# EAGLE design Printplaat version 1 with 4-20mA problems (EAGLE 9.7.0)
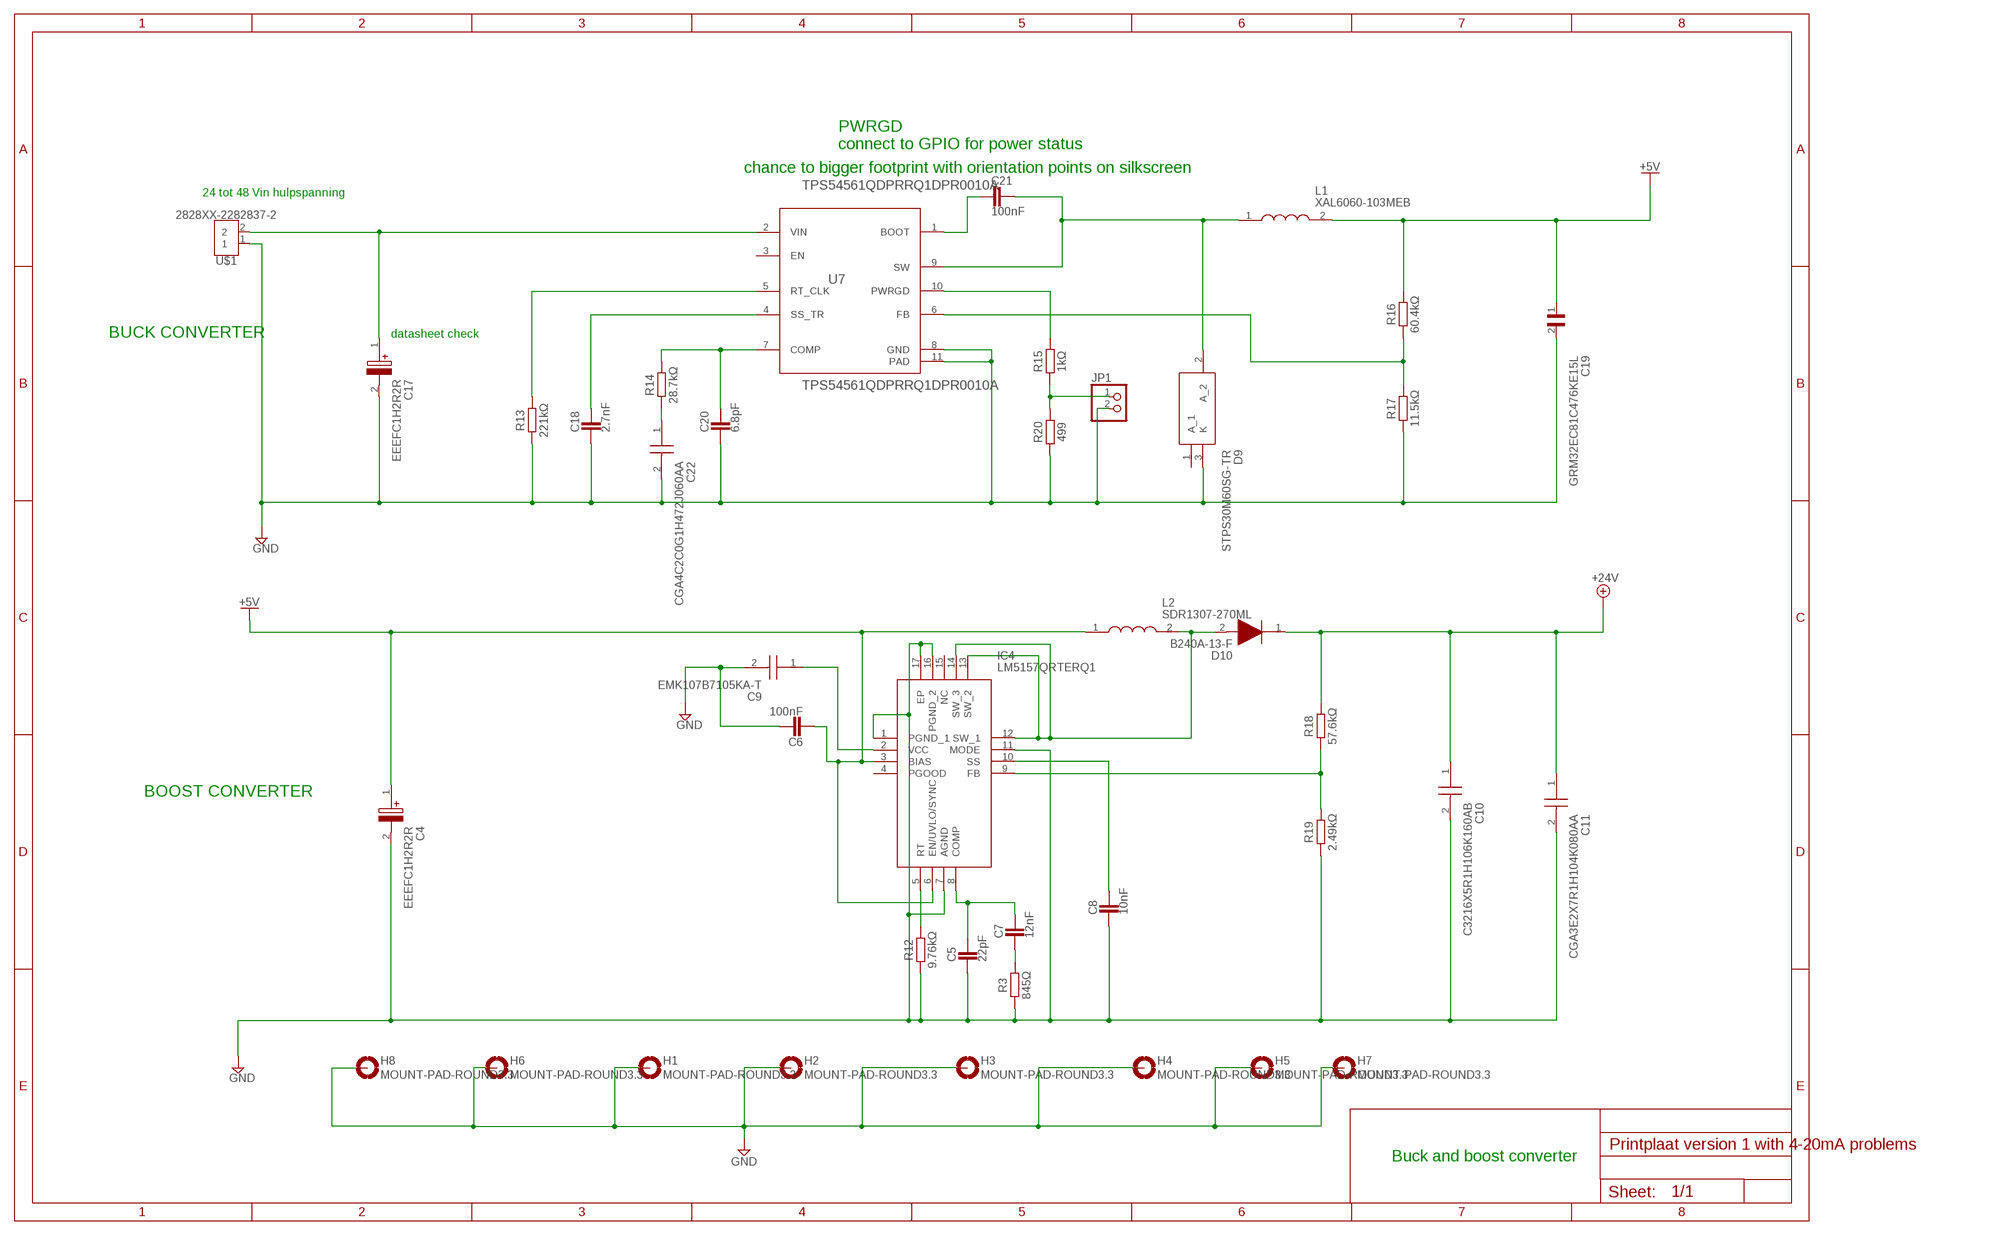
[diagram p0: schematic, sheet 1, part 1 of 3]
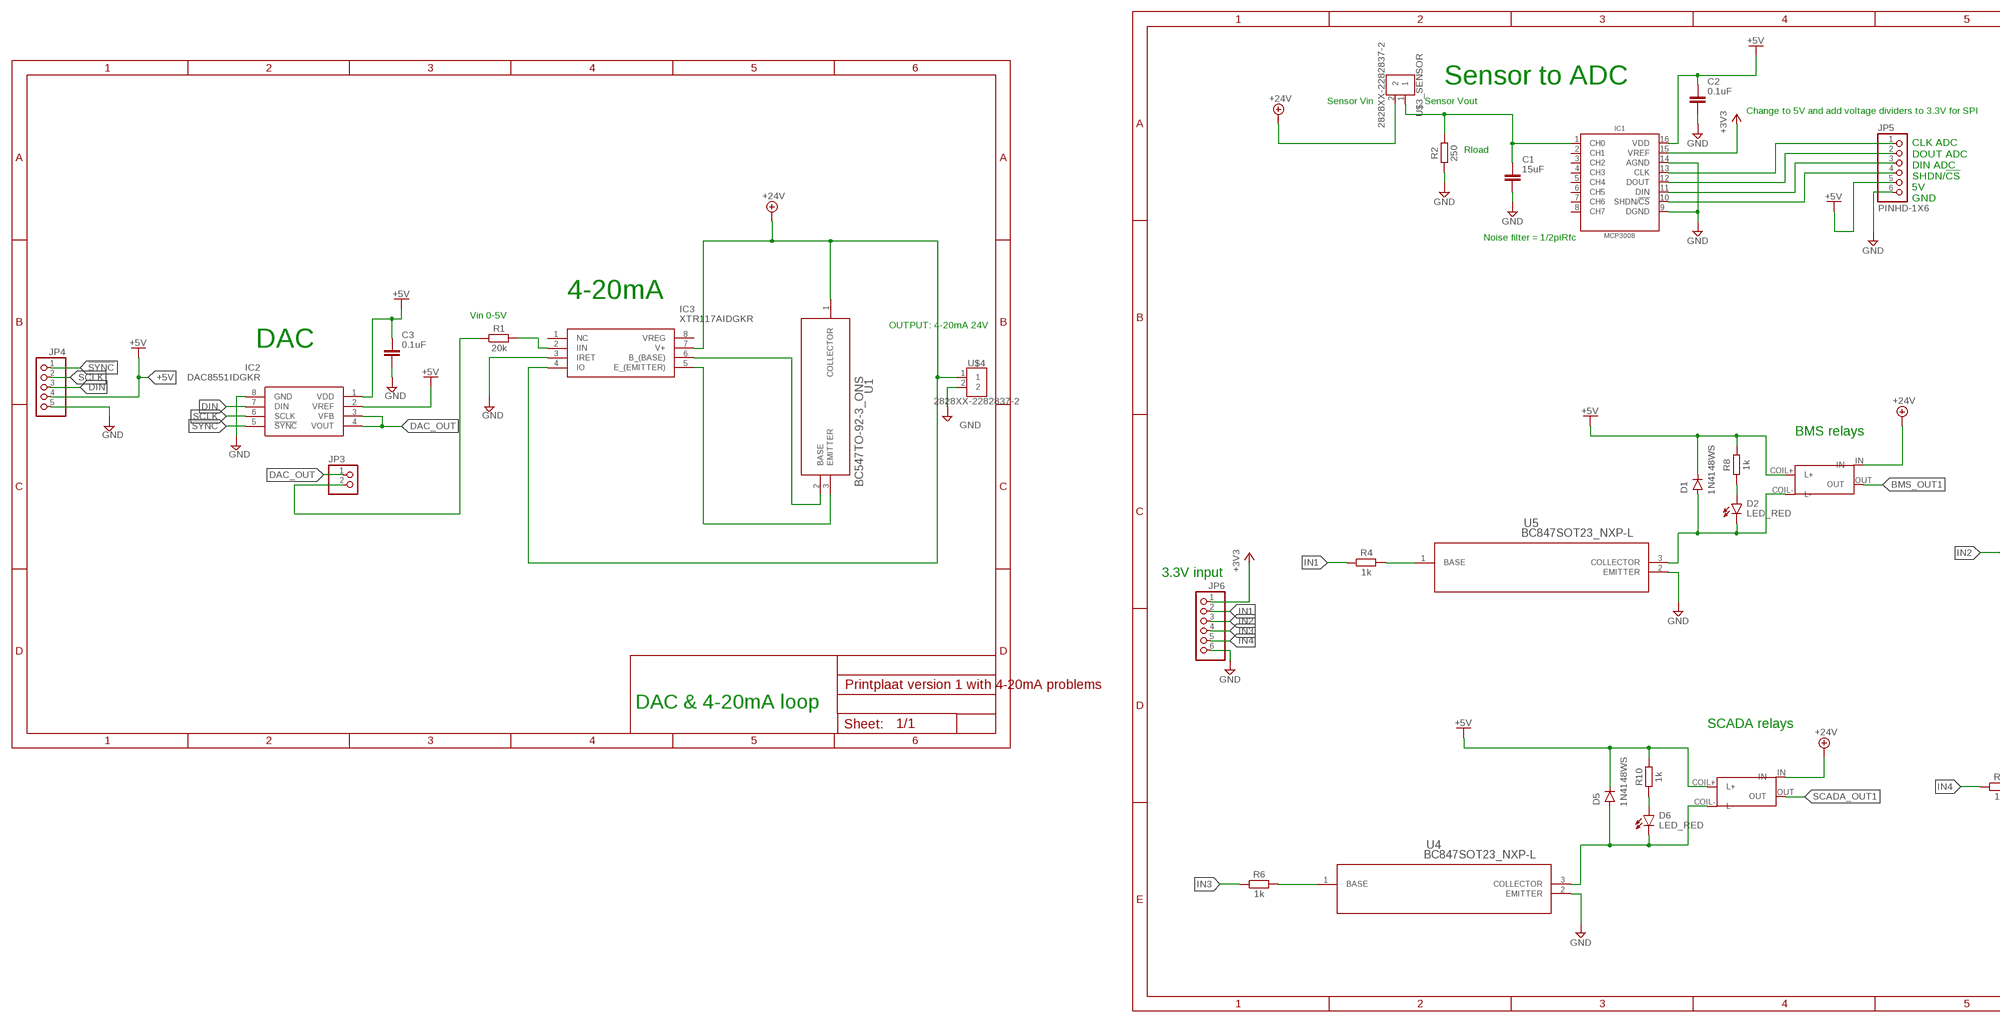
[diagram p1: schematic, sheet 1, part 2 of 3]
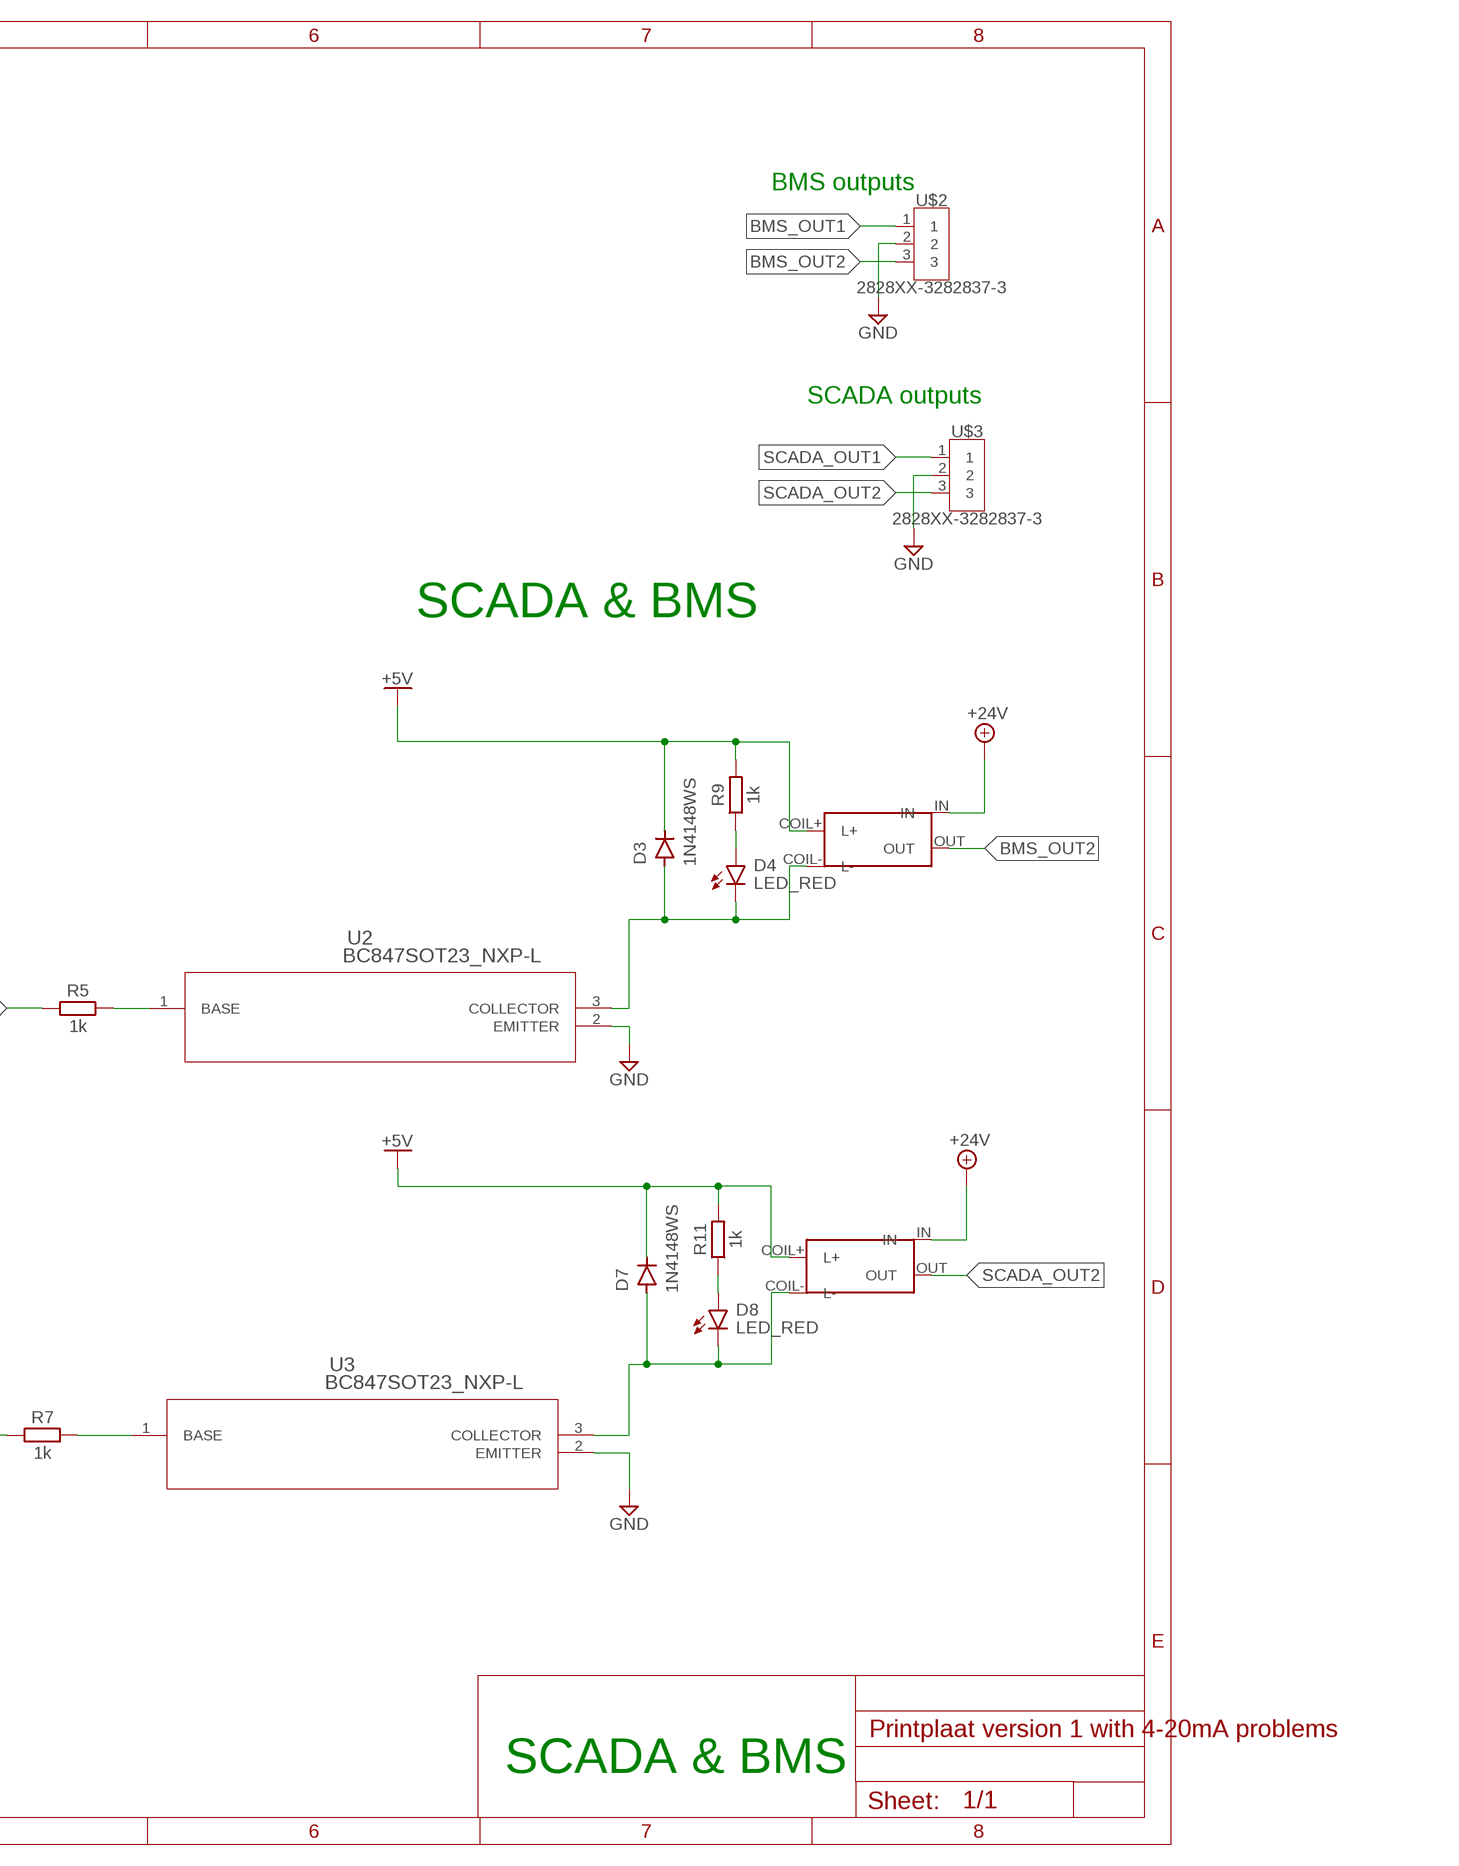
[diagram p2: schematic, sheet 1, part 3 of 3]

## Parts
C1  15uF  C_CHIP-1206(3216-METRIC)  [CAPC3216X135]
C2  0.1uF  C_CHIP-1206(3216-METRIC)  [CAPC3216X135]
C3  0.1uF  C_CHIP-1206(3216-METRIC)  [CAPC3216X135]
C4  EEEFC1H2R2R  [EEE1AA220WR]
C5  22pF  CAPACITOR_CHIP-1206(3216-METRIC)  [CAPC3216X135]
C6  100nF  CAPACITOR_CHIP-1206(3216-METRIC)  [CAPC3216X135]
C7  12nF  CAPACITOR_CHIP-1206(3216-METRIC)  [CAPC3216X135]
C8  10nF  CAPACITOR_CHIP-1206(3216-METRIC)  [CAPC3216X135]
C9  EMK107B7105KA-T  [CAPC1608X90N]
C10  C3216X5R1H106K160AB  [CAPC3216X180N]
C11  CGA3E2X7R1H104K080AA  [CAPC1608X90N]
C17  EEEFC1H2R2R  [EEE1AA220WR]
C18  2.7nF  CAPACITOR_CHIP-1206(3216-METRIC)  [CAPC3216X135]
C19  GRM32EC81C476KE15L  [CAPC3225X270N]
C20  6.8pF  CAPACITOR_CHIP-1206(3216-METRIC)  [CAPC3216X135]
C21  100nF  CAPACITOR_CHIP-1206(3216-METRIC)  [CAPC3216X135]
C22  CGA4C2C0G1H472J060AA  [CAPC2012X75N]
D1  1N4148WS  [SOD-323]
D2  LED_RED  CHIP-FLAT-R_1206  [LEDC3216X75N_FLAT-R]
D3  1N4148WS  [SOD-323]
D4  LED_RED  CHIP-FLAT-R_1206  [LEDC3216X75N_FLAT-R]
D5  1N4148WS  [SOD-323]
D6  LED_RED  CHIP-FLAT-R_1206  [LEDC3216X75N_FLAT-R]
D7  1N4148WS  [SOD-323]
D8  LED_RED  CHIP-FLAT-R_1206  [LEDC3216X75N_FLAT-R]
D9  STPS30M60SG-TR  [T1210T8G]
D10  B240A-13-F  [DIOM5226X230N]
H1  MOUNT-PAD-ROUND3.3  [3,3-PAD]
H2  MOUNT-PAD-ROUND3.3  [3,3-PAD]
H3  MOUNT-PAD-ROUND3.3  [3,3-PAD]
H4  MOUNT-PAD-ROUND3.3  [3,3-PAD]
H5  MOUNT-PAD-ROUND3.3  [3,3-PAD]
H6  MOUNT-PAD-ROUND3.3  [3,3-PAD]
H7  MOUNT-PAD-ROUND3.3  [3,3-PAD]
H8  MOUNT-PAD-ROUND3.3  [3,3-PAD]
IC1  MCP3008  MCP3008_PDIP  [DIP1092W56P254L1905H432Q16B]
IC2  DAC8551IDGKR  [SOP65P490X110-8N]
IC3  XTR117AIDGKR  [SOP65P490X110-8N]
IC4  LM5157QRTERQ1  [QFN50P300X300X80-17N]
JP1  PINHD-1X2  [1X02]
JP3  PINHD-1X2  [1X02]
JP4  PINHD-1X5  [1X05]
JP5  PINHD-1X6  [1X06]
JP6  PINHD-1X6  [1X06]
L1  XAL6060-103MEB  [XAL6060-103MEB]
L2  SDR1307-270ML  [SDR1307270ML]
R1  20k  RESISTOR__CHIP-1206(3216-METRIC)  [RESC3216X70]
R2  250  RESISTOR__CHIP-1206(3216-METRIC)  [RESC3216X70]
R3  845Ω  RESISTOR__CHIP-1206(3216-METRIC)  [RESC3216X70]
R4  1k  RESISTOR__CHIP-1206(3216-METRIC)  [RESC3216X70]
R5  1k  RESISTOR__CHIP-1206(3216-METRIC)  [RESC3216X70]
R6  1k  RESISTOR__CHIP-1206(3216-METRIC)  [RESC3216X70]
R7  1k  RESISTOR__CHIP-1206(3216-METRIC)  [RESC3216X70]
R8  1k  RESISTOR__CHIP-1206(3216-METRIC)  [RESC3216X70]
R9  1k  RESISTOR__CHIP-1206(3216-METRIC)  [RESC3216X70]
R10  1k  RESISTOR__CHIP-1206(3216-METRIC)  [RESC3216X70]
R11  1k  RESISTOR__CHIP-1206(3216-METRIC)  [RESC3216X70]
R12  9.76kΩ  RESISTOR__CHIP-1206(3216-METRIC)  [RESC3216X70]
R13  221kΩ  RESISTOR__CHIP-1206(3216-METRIC)  [RESC3216X70]
R14  28.7kΩ  RESISTOR__CHIP-1206(3216-METRIC)  [RESC3216X70]
R15  1kΩ  RESISTOR__CHIP-1206(3216-METRIC)  [RESC3216X70]
R16  60.4kΩ  RESISTOR__CHIP-1206(3216-METRIC)  [RESC3216X70]
R17  11.5kΩ  RESISTOR__CHIP-1206(3216-METRIC)  [RESC3216X70]
R18  57.6kΩ  RESISTOR__CHIP-1206(3216-METRIC)  [RESC3216X70]
R19  2.49kΩ  RESISTOR__CHIP-1206(3216-METRIC)  [RESC3216X70]
R20  499  RESISTOR__CHIP-1206(3216-METRIC)  [RESC3216X70]
RELAY1  ZETTLER_5V_RELAY  [ZETTLER_5V_RELAY]
RELAY2  ZETTLER_5V_RELAY  [ZETTLER_5V_RELAY]
RELAY3  ZETTLER_5V_RELAY  [ZETTLER_5V_RELAY]
RELAY4  ZETTLER_5V_RELAY  [ZETTLER_5V_RELAY]
U1  BC547TO-92-3_ONS  [TO-92-3_ONS]
U2  BC847SOT23_NXP-L  [SOT23_NXP-L]
U3  BC847SOT23_NXP-L  [SOT23_NXP-L]
U4  BC847SOT23_NXP-L  [SOT23_NXP-L]
U5  BC847SOT23_NXP-L  [SOT23_NXP-L]
U7  TPS54561QDPRRQ1DPR0010A  [DPR0010A]
U$1  2828XX-2282837-2  [TERMBLK_508-2N]
U$2  2828XX-3282837-3  [TERMBLK_508-3N]
U$3  2828XX-3282837-3  [TERMBLK_508-3N]
U$3_SENSOR  2828XX-2282837-2  [TERMBLK_508-2N]
U$4  2828XX-2282837-2  [TERMBLK_508-2N]

## Nets
!SYNC: IC2.5(!SYNC) JP4.1
+3V3: IC1.15(VREF) JP6.1
+5V: C2.1 C3.1 C4.1(+) C6.2 C19.1 D1.C D3.C D5.C D7.C IC1.16(VDD) IC2.1(VDD) IC2.2(VREF) IC4.3(BIAS) IC4.6(EN/UVLO/SYNC) JP4.4 JP5.5 L1.2 L2.1 R8.2 R9.2 R10.2 R11.2 R16.2 RELAY1.COIL+(L+) RELAY2.COIL+(L+) RELAY3.COIL+(L+) RELAY4.COIL+(L+)
+24V: C10.1 C11.1 D10.1(K) IC3.4(IO) IC3.7(V+) R18.2 RELAY1.IN RELAY2.IN RELAY3.IN RELAY4.IN U1.1(COLLECTOR) U$3_SENSOR.2 U$4.1
BMS_OUT1: RELAY1.OUT U$2.1
BMS_OUT2: RELAY2.OUT U$2.3
DAC_OUT: IC2.3(VFB) IC2.4(VOUT) JP3.1
DIN: IC2.7(DIN) JP4.3
GND: C1.2 C2.2 C3.2 C4.2(-) C5.2 C6.1 C8.2 C9.2 C10.2 C11.2 C17.2(-) C18.2 C19.2 C20.2 C22.2 D9.3(K) H1.B3,3(MOUNT) H2.B3,3(MOUNT) H3.B3,3(MOUNT) H4.B3,3(MOUNT) H5.B3,3(MOUNT) H6.B3,3(MOUNT) H7.B3,3(MOUNT) H8.B3,3(MOUNT) IC1.9(DGND) IC1.14(AGND) IC2.8(GND) IC3.3(IRET) IC4.1(PGND_1) IC4.7(AGND) IC4.11(MODE) IC4.16(PGND_2) IC4.17(EP) JP1.2 JP4.5 JP5.6 JP6.6 R2.1 R3.1 R12.1 R13.1 R17.1 R19.1 R20.1 U2.2(EMITTER) U3.2(EMITTER) U4.2(EMITTER) U5.2(EMITTER) U7.8(GND) U7.11(PAD) U$1.1 U$2.2 U$3.2 U$4.2
IN1: JP6.2 R4.1
IN2: JP6.3 R5.1
IN3: JP6.4 R6.1
IN4: JP6.5 R7.1
N$1: IC3.6(B_(BASE)) U1.2(BASE)
N$2: JP3.2 R1.1
N$3: IC3.5(E_(EMITTER)) U1.3(EMITTER)
N$4: IC3.2(IIN) R1.2
N$5: R5.2 U2.1(BASE)
N$6: C1.1 IC1.1(CH0) R2.2 U$3_SENSOR.1
N$7: IC1.10(SHDN/!CS) JP5.4
N$8: IC1.11(DIN) JP5.3
N$9: IC1.12(DOUT) JP5.2
N$10: IC1.13(CLK) JP5.1
N$11: D3.A D4.C RELAY2.COIL-(L-) U2.3(COLLECTOR)
N$12: D4.A R9.1
N$13: R6.2 U4.1(BASE)
N$14: R4.2 U5.1(BASE)
N$15: D2.A R8.1
N$16: D1.A D2.C RELAY1.COIL-(L-) U5.3(COLLECTOR)
N$17: D5.A D6.C RELAY3.COIL-(L-) U4.3(COLLECTOR)
N$18: D6.A R10.1
N$19: D7.A D8.C RELAY4.COIL-(L-) U3.3(COLLECTOR)
N$20: D8.A R11.1
N$21: R7.2 U3.1(BASE)
N$22: C17.1(+) U7.2(VIN) U$1.2
N$23: R13.2 U7.5(RT_CLK)
N$24: C18.1 U7.4(SS_TR)
N$25: C22.1 R14.1
N$26: C20.1 R14.2 U7.7(COMP)
N$27: C21.2 U7.1(BOOT)
N$28: C21.1 D9.2(A_2) L1.1 U7.9(SW)
N$29: R15.2 U7.10(PWRGD)
N$30: R16.1 R17.2 U7.6(FB)
N$31: C9.1 IC4.2(VCC)
N$32: C5.1 C7.1 IC4.8(COMP)
N$33: C7.2 R3.2
N$34: C8.1 IC4.10(SS)
N$35: IC4.5(RT) R12.2
N$36: D10.2(A) IC4.12(SW_1) IC4.13(SW_2) IC4.14(SW_3) L2.2
N$37: IC4.9(FB) R18.1 R19.2
N$38: JP1.1 R15.1 R20.2
SCADA_OUT1: RELAY3.OUT U$3.1
SCADA_OUT2: RELAY4.OUT U$3.3
SCLK: IC2.6(SCLK) JP4.2
Unconnected: D9.1(A_1) IC1.2(CH1) IC1.3(CH2) IC1.4(CH3) IC1.5(CH4) IC1.6(CH5) IC1.7(CH6) IC1.8(CH7) IC3.1(NC) IC3.8(VREG) IC4.4(PGOOD) IC4.15(NC) U7.3(EN)

## Notes on the sheet
- PWRGD 
  connect to GPIO for power status
- chance to bigger footprint with orientation points on silkscreen
- 24 tot 48 Vin hulpspanning
- BUCK CONVERTER | datasheet check
- BOOST CONVERTER
- Buck and boost converter
- Sensor to ADC
- Sensor Vin | Sensor Vout | BMS outputs
- Change to 5V and add voltage dividers to 3.3V for SPI
- Rload
- CLK ADC
  DOUT ADC
  DIN ADC
  SHDN/!CS
  5V
  GND
- SCADA outputs
- Noise filter = 1/2piRfc
- 4-20mA
- Vin 0-5V
- OUTPUT: 4-20mA 24V
- SCADA & BMS
- DAC
- BMS relays
- 3.3V input
- DAC & 4-20mA loop
- SCADA relays
- SCADA & BMS

## Library data of the parts
C1-C3 = Capacitor:C: Capacitor - Generic; CATEGORY: Capacitor
C4 C17 = EEEFC1H2R2R:EEEFC1H2R2R: Panasonic 2.2uF 50V dc Aluminium Electrolytic Capacitor, Surface Mount 4 (Dia.) x 5.4mm +105C 4mm Source: Datasheet <http://industrial.panasonic.com/cdbs/www-data/pdf/RDE0000/ABA0000C1172.pdf>; DESCRIPTION: Panasonic 2.2uF 50V dc Aluminium Electrolytic Capacitor, Surface Mount 4 (Dia.) x 5.4mm +105C 4mm; HEIGHT: 5.5mm; MANUFACTURER_NAME: Panasonic; MANUFACTURER_PART_NUMBER: EEEFC1H2R2R
C5-C8 C18 C20 C21 = Tinkercad:CAPACITOR: Capacitor - Generic; CATEGORY: Capacitor
C9 = EMK107B7105KA-T:EMK107B7105KA-T: Ceramic Capacitor 0603 16V 1uF Source: Datasheet <https://componentsearchengine.com/Datasheets/1/EMK107B7105KA-T.pdf>; DESCRIPTION: Ceramic Capacitor 0603 16V 1uF; HEIGHT: 0.9mm; MANUFACTURER_NAME: TAIYO YUDEN; MANUFACTURER_PART_NUMBER: EMK107B7105KA-T; MOUSER_PART_NUMBER: 963-EMK107B7105KA-T; MOUSER_PRICE-STOCK: https://www.mouser.co.uk/ProductDetail/TAIYO-YUDEN/EMK107B7105KA-T?qs=I6KAKw0tg2zS1zj87Lm%2FxQ%3D%3D
C10 = C3216X5R1H106K160AB:C3216X5R1H106K160AB: 1206 X5R ceramic capacitor 10uF 50V TDK 1206 C 10F Ceramic Multilayer Capacitor, 50 V dc X5R Dielectric +/-10% SMD Source: Datasheet <https://product.tdk.com/info/en/catalog/datasheets/mlcc_commercial_midvoltage_en.pdf>; DESCRIPTION: 1206 X5R ceramic capacitor 10uF 50V TDK 1206 C 10F Ceramic Multilayer Capacitor, 50 V dc X5R Dielectric +/-10% SMD; HEIGHT: 1.8mm; MANUFACTURER_NAME: TDK; MANUFACTURER_PART_NUMBER: C3216X5R1H106K160AB; MOUSER_PART_NUMBER: 810-C3216X5R1H106K; MOUSER_PRICE-STOCK: https://www.mouser.co.uk/ProductDetail/TDK/C3216X5R1H106K160AB?qs=NRhsANhppD%252BLHMbxvQzsEQ%3D%3D
C11 = CGA3E2X7R1H104K080AA:CGA3E2X7R1H104K080AA: Multilayer Ceramic Chip Capacitors, Capacitance=0.1uF, LxWxT:1.6x0.8x0.8mm Source: Datasheet; DESCRIPTION: Multilayer Ceramic Chip Capacitors, Capacitance=0.1uF, LxWxT:1.6x0.8x0.8mm; HEIGHT: 0.9mm; MANUFACTURER_NAME: TDK; MANUFACTURER_PART_NUMBER: CGA3E2X7R1H104K080AA; MOUSER_PART_NUMBER: 810-CGA3E2X7R1H104K; MOUSER_PRICE-STOCK: https://www.mouser.co.uk/ProductDetail/TDK/CGA3E2X7R1H104K080AA?qs=NRhsANhppD%2Fge2a869G9Fg%3D%3D
C19 = GRM32EC81C476KE15L:GRM32EC81C476KE15L: SMD Capacitor X6S(EIA) with Capacitance: 47uF Tol. 10%. Rated Voltage: 16Vdc Check availability <https://pricing.snapeda.com/parts/GRM32EC81C476KE15L/Murata%20Electronics/view-part?ref=eda>; AVAILABILITY: In Stock; CHECK_PRICES: https://www.snapeda.com/parts/GRM32EC81C476KE15L/Murata/view-part/?ref=eda; DESCRIPTION: 47 µF ±10% 16V Ceramic Capacitor X6S 1210 (3225 Metric); MF: Murata Electronics; MP: GRM32EC81C476KE15L; PACKAGE: 3225 Murata; PRICE: None; SNAPEDA_LINK: https://www.snapeda.com/parts/GRM32EC81C476KE15L/Murata/view-part/?ref=snap
C22 = CGA4C2C0G1H472J060AA:CGA4C2C0G1H472J060AA: Multilayer Ceramic Chip Capacitors, Capacitance=4.7nF, LxWxT:2x1.25x0.6mm Source: Datasheet; DESCRIPTION: Multilayer Ceramic Chip Capacitors, Capacitance=4.7nF, LxWxT:2x1.25x0.6mm; HEIGHT: 0.75mm; MANUFACTURER_NAME: TDK; MANUFACTURER_PART_NUMBER: CGA4C2C0G1H472J060AA; MOUSER_PART_NUMBER: 810-CGA4C2C0G1H472J; MOUSER_PRICE-STOCK: https://www.mouser.co.uk/ProductDetail/TDK/CGA4C2C0G1H472J060AA?qs=FxQuwy19cyCgdYzJw5%252BHfA%3D%3D
D1 D3 D5 D7 = Diodes:1N4148WS: DIODE GEN PURP 75V 150MA SOD323F Manufacturer's datasheet <https://www.onsemi.com/pub/Collateral/1N914BWS-D.pdf>; CREATED_BY: PCBLayout.com; DIGIKEY_PART_NUMBER: 1N4148WSFSTR-ND; MANUFACTURER: Diodes Incorporated; MPN: 1N4148WS; PACKAGE: SOD-323
D2 D4 D6 D8 = LED:CHIP-FLAT-R; CATEGORY: LED; COLOR: RED; DESCRIPTION: CHIP LED FLAT; SUB-CATEGORY: CHIP; TYPE: FLAT_TOP
D9 = STPS30M60SG-TR:STPS30M60SG-TR: STMicroelectronics STPS30M60SG-TR, SMT Schottky Diode, 60V 30A, 3-Pin D2PAK Source: Datasheet <https://componentsearchengine.com/Datasheets/1/STPS30M60SG-TR.pdf>; DESCRIPTION: STMicroelectronics STPS30M60SG-TR, SMT Schottky Diode, 60V 30A, 3-Pin D2PAK; HEIGHT: 4mm; MANUFACTURER_NAME: STMicroelectronics; MANUFACTURER_PART_NUMBER: STPS30M60SG-TR; MOUSER_PART_NUMBER: 511-STPS30M60SG-TR; MOUSER_PRICE-STOCK: https://www.mouser.co.uk/ProductDetail/STMicroelectronics/STPS30M60SG-TR?qs=G49gCGQm93g67AcseEWC2A%3D%3D
D10 = B240A-13-F:B240A-13-F: Schottky Diode 2A 40V 0.5Vf SMA Diodes Inc B240A-13-F, SMT Schottky Diode, 40V 2A, 2-Pin DO-214AC Source: Datasheet <https://datasheet.datasheetarchive.com/originals/distributors/SFDatasheet-0/sf-0003166.pdf>; DESCRIPTION: Schottky Diode 2A 40V 0.5Vf SMA Diodes Inc B240A-13-F, SMT Schottky Diode, 40V 2A, 2-Pin DO-214AC; HEIGHT: 2.3mm; MANUFACTURER_NAME: Diodes Incorporated; MANUFACTURER_PART_NUMBER: B240A-13-F; MOUSER_PART_NUMBER: 621-B240A-F; MOUSER_PRICE-STOCK: https://www.mouser.co.uk/ProductDetail/Diodes-Incorporated/B240A-13-F?qs=idJYQZufS6jleWUCPMvVdQ%3D%3D
H1-H8 = holes:MOUNT-PAD-ROUND: MOUNTING PAD, round
IC1 = IC_Data-Conversion:MCP3008: 2.7V 4-Channel/8-Channel 10-Bit A/D Converters with SPI™ Serial Interface Datasheet <https://www.mouser.in/datasheet/2/268/21295b-72710.pdf>; CATEGORY: IC_Data-Conversion; DESCRIPTION: IC ADC 10BIT SAR 16DIP; MANUFACTURER: Microchip Technology; MPN: MCP3008-I/P; OPERATINGTEMP: -40 to +85°C; PART_STATUS: Active; ROHS_COMPLIANT: Compliant; SUB-CATEGORY: A/D Converter
IC2 = DAC8551IDGKR:DAC8551IDGKR: 16-Bit, Ultralow Glitch, Voltage Output, Digital to Analog Converter Source: Datasheet <http://www.ti.com/lit/gpn/DAC8551>; DESCRIPTION: 16-Bit, Ultralow Glitch, Voltage Output, Digital to Analog Converter; HEIGHT: 1.1mm; MANUFACTURER_NAME: Texas Instruments; MANUFACTURER_PART_NUMBER: DAC8551IDGKR; MOUSER_PART_NUMBER: 595-DAC8551IDGKR; MOUSER_PRICE-STOCK: https://www.mouser.co.uk/ProductDetail/Texas-Instruments/DAC8551IDGKR?qs=vul0MlC%2Fa1dStr8sTUNGkA%3D%3D
IC3 = XTR117AIDGKR:XTR117AIDGKR: Sensor Interface XTR117 4-20mA Crnt Loop Transmitter Source: Datasheet <http://www.ti.com/lit/ds/symlink/xtr117.pdf>; DESCRIPTION: Sensor Interface XTR117 4-20mA Crnt Loop Transmitter; HEIGHT: 1.1mm; MANUFACTURER_NAME: Texas Instruments; MANUFACTURER_PART_NUMBER: XTR117AIDGKR; MOUSER_PART_NUMBER: 595-XTR117AIDGKR; MOUSER_PRICE-STOCK: https://www.mouser.co.uk/ProductDetail/Texas-Instruments/XTR117AIDGKR?qs=zqbRmZ%252BfZD%252BYMdmF%252BmhQwg%3D%3D
IC4 = LM5157QRTERQ1:LM5157QRTERQ1: Switching Voltage Regulators 6-A, 50-V, 2.2-MHz wide VIN boost, flyback, & SEPIC converter with dual random spread spectrum Source: Datasheet <https://pdf1.alldatasheet.com/datasheet-pdf/view/1264204/TI/LM5157QRTERQ1.html>; DESCRIPTION: Switching Voltage Regulators 6-A, 50-V, 2.2-MHz wide VIN boost, flyback, & SEPIC converter with dual random spread spectrum; HEIGHT: 0.8mm; MANUFACTURER_NAME: Texas Instruments; MANUFACTURER_PART_NUMBER: LM5157QRTERQ1; MOUSER_PART_NUMBER: 595-LM5157QRTERQ1; MOUSER_PRICE-STOCK: https://www.mouser.co.uk/ProductDetail/Texas-Instruments/LM5157QRTERQ1?qs=QNEnbhJQKvb8%252BoI1%252BJEaeg%3D%3D
JP1 JP3 = pinhead:PINHD-1X2: PIN HEADER
JP4 = pinhead:PINHD-1X5: PIN HEADER
JP5 = Connector:PINHD-1X6: PIN HEADER; CATEGORY: CONNECTOR; SUB-CATEGORY: PIN-HEADER
JP6 = pinhead:PINHD-1X6: PIN HEADER
L1 = XAL6060-103MEB:XAL6060-103MEB: Fixed Inductors XAL6060 High Current 10 uH 20% 7 A Compos Source: Datasheet; DESCRIPTION: Fixed Inductors XAL6060 High Current 10 uH 20% 7 A Compos; HEIGHT: mm; MANUFACTURER_NAME: COILCRAFT; MANUFACTURER_PART_NUMBER: XAL6060-103MEB; MOUSER_PART_NUMBER: 994-XAL6060-103MEB; MOUSER_PRICE-STOCK: https://www.mouser.co.uk/ProductDetail/Coilcraft/XAL6060-103MEB?qs=VJjuEbE9QBODk8cxO8T25A%3D%3D
L2 = SDR1307-270ML:SDR1307-270ML: Fixed Inductors 27uH 20% SMD 1307 Source: Datasheet <https://www.bourns.com/pdfs/SDR1307.pdf>; DESCRIPTION: Fixed Inductors 27uH 20% SMD 1307; HEIGHT: 7.3mm; MANUFACTURER_NAME: Bourns; MANUFACTURER_PART_NUMBER: SDR1307-270ML; MOUSER_PART_NUMBER: 652-SDR1307-270ML; MOUSER_PRICE-STOCK: https://www.mouser.co.uk/ProductDetail/Bourns/SDR1307-270ML?qs=96C2vqMyhurCDUZOgzNoEQ%3D%3D
R1-R20 = Tinkercad:RESISTOR: Resistor Fixed - Generic; CATEGORY: Resistor; SUB-CATEGORY: Fixed
RELAY1-RELAY4 = Zettler AZ9371-1A-5D:ZETTLER_5V_RELAY
U1 = 2024-10-31_09-00-07_Library:BC547; COPYRIGHT: Copyright (C) 2024 Ultra Librarian. All rights reserved.; MANUFACTURER_PART_NUMBER: BC547; MFR_NAME: onsemi
U2-U5 = 2024-10-31_10-28-23_Library:BC847; COPYRIGHT: Copyright (C) 2024 Ultra Librarian. All rights reserved.; MANUFACTURER_PART_NUMBER: BC847; MFR_NAME: NXP
U7 = 2024-10-11_09-28-41_Library:TPS54561QDPRRQ1; COPYRIGHT: Copyright (C) 2024 Ultra Librarian. All rights reserved.; MANUFACTURER_PART_NUMBER: TPS54561QDPRRQ1; MFR_NAME: Texas Instruments; REFDES: RefDes; TYPE: TYPE
U$1 U$3_SENSOR U$4 = Connector:2828XX-2: 2 Position Wire to Board Terminal Block Horizontal with Board Datasheet <https://www.te.com.cn/commerce/DocumentDelivery/DDEController?Action=showdoc&DocId=Catalog+Section%7F1308389_EUROSTYLE_TERMINAL_BLOCKS%7F0607%7Fpdf%7FEnglish%7FENG_CS_1308389_EUROSTYLE_TERMINAL_BLOCKS_0607.pdf%7F2-282837-5>; CATEGORY: Connector; DESCRIPTION: 2 Position Wire to Board Terminal Block Horizontal with Board 5.08 mm Through Hole; MANUFACTURER: TE Connectivity; MPN: 282837-2; OPERATING_TEMPERATURE: -40°C to +105°C; PART_STATUS: ACTIVE; ROHS_COMPLIANCE: RoHS Compliant; SERIES: 282837; SUBCATEGORY: Terminal Block; TYPE: Side Wire Entry
U$2 U$3 = Connector:2828XX-3: 3 Position Wire to Board Terminal Block Horizontal with Board Datasheet <https://www.te.com.cn/commerce/DocumentDelivery/DDEController?Action=showdoc&DocId=Catalog+Section%7F1308389_EUROSTYLE_TERMINAL_BLOCKS%7F0607%7Fpdf%7FEnglish%7FENG_CS_1308389_EUROSTYLE_TERMINAL_BLOCKS_0607.pdf%7F2-282837-5>; CATEGORY: Connector; DESCRIPTION: TERM BLK 3P SIDE ENT 5.08mm PCB; MANUFACTURER: TE Connectivity; MPN: 282837-3; OPERATING_TEMPERATURE: -40°C to +105°C; PART_STATUS: Active; ROHS_COMPLIANCE: RoHS Compliant; SERIES: 282837; SUBCATEGORY: Terminal Block; TYPE: Side Wire Entry

## Board
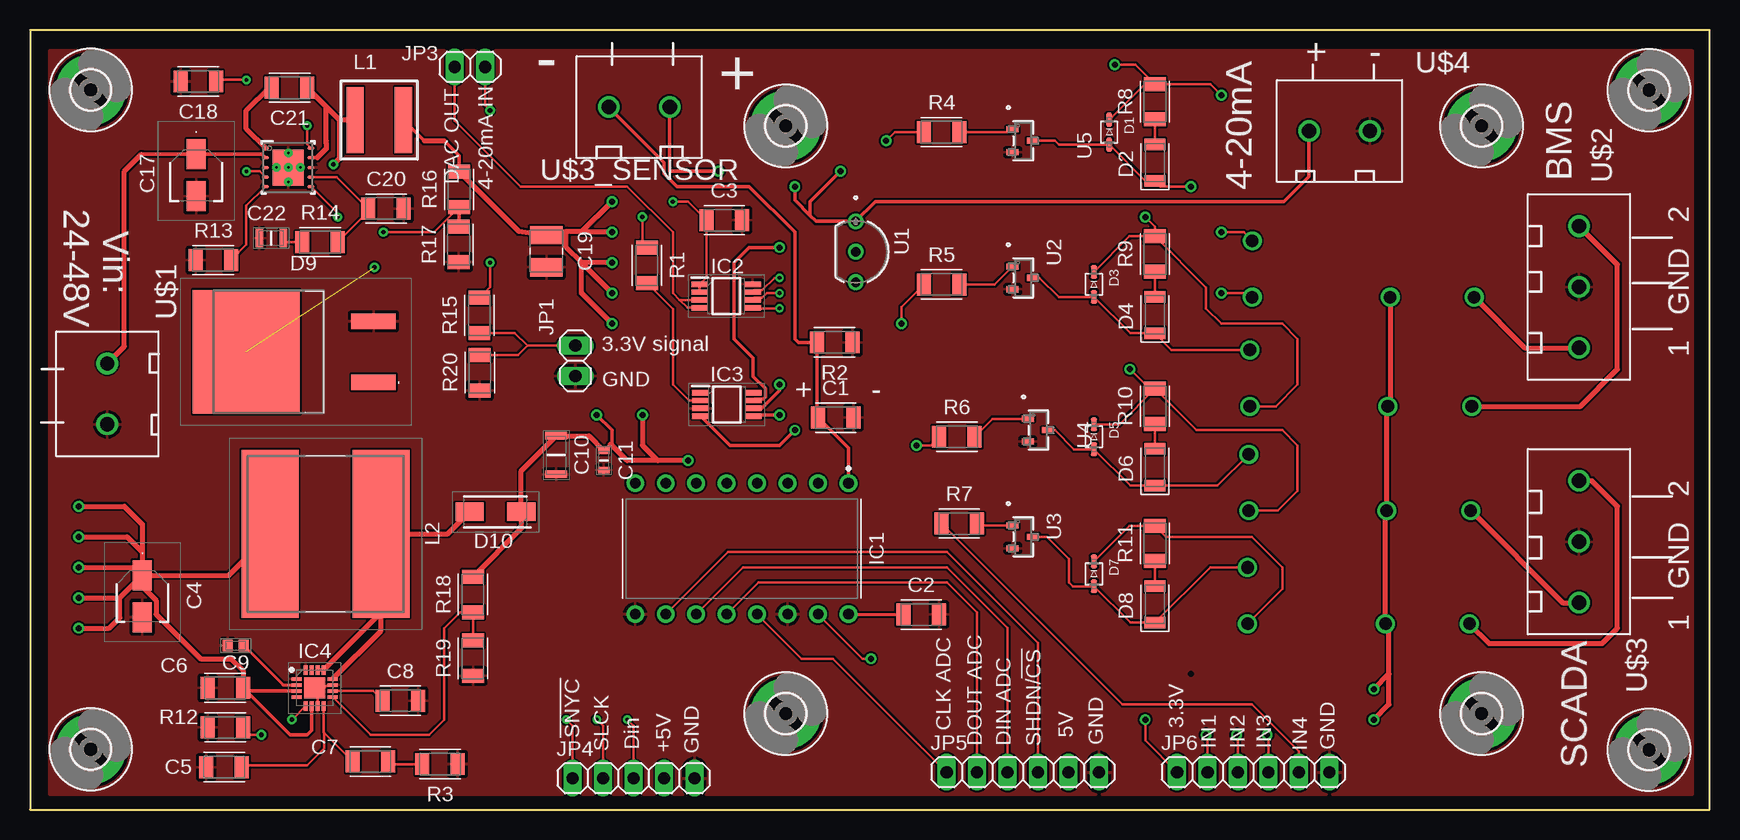
[diagram p3: board, top side]
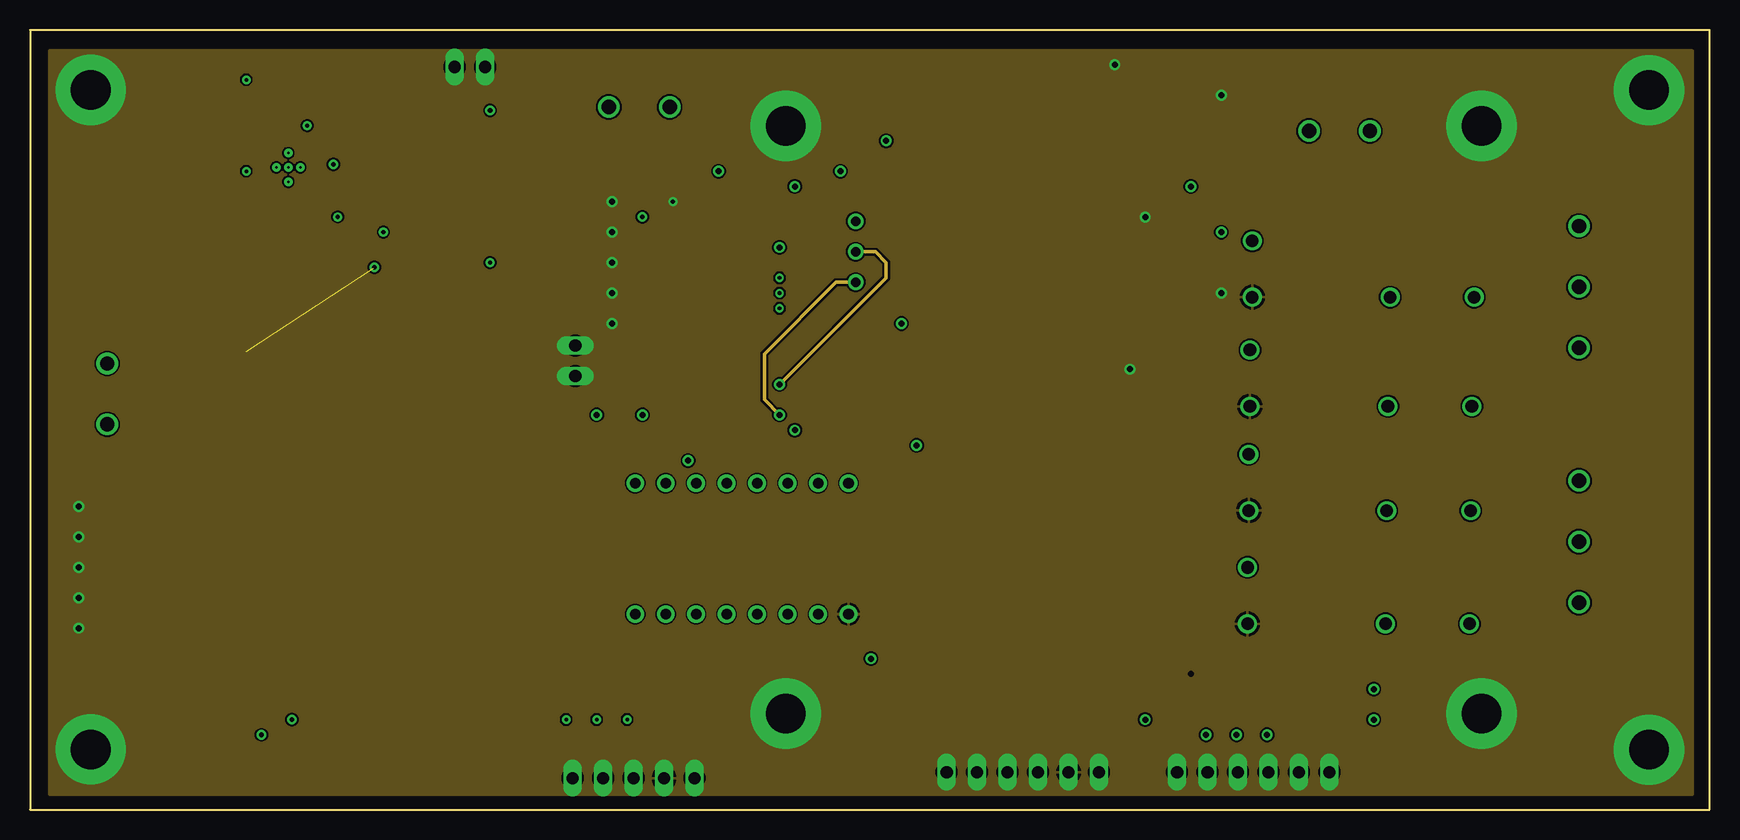
[diagram p4: board, inner layer Route2]
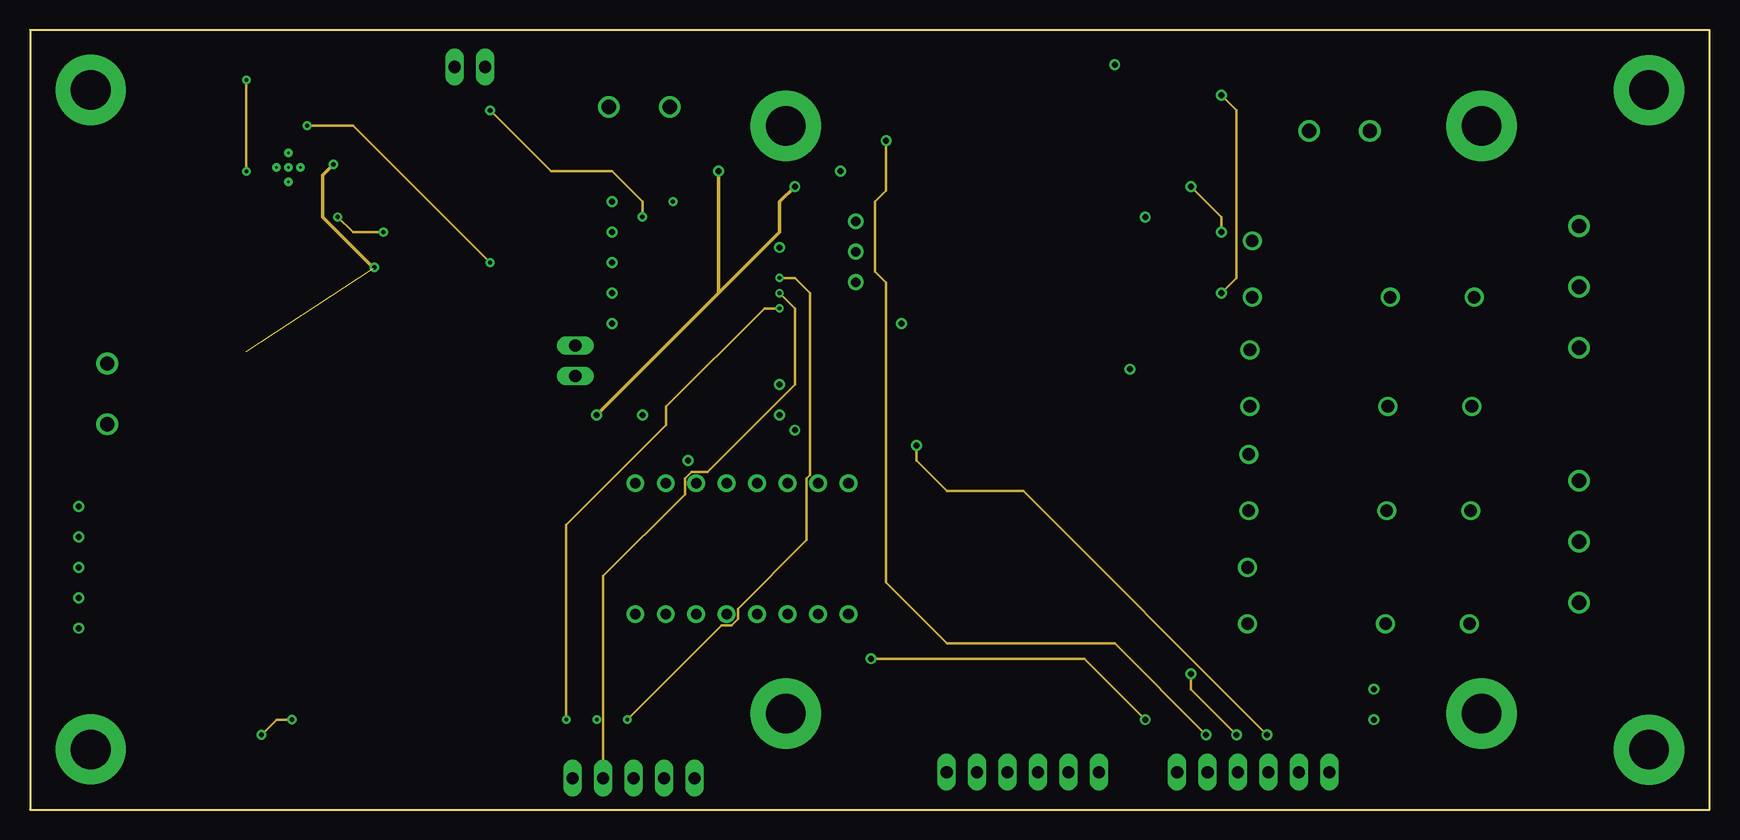
[diagram p5: board, inner layer Route15]
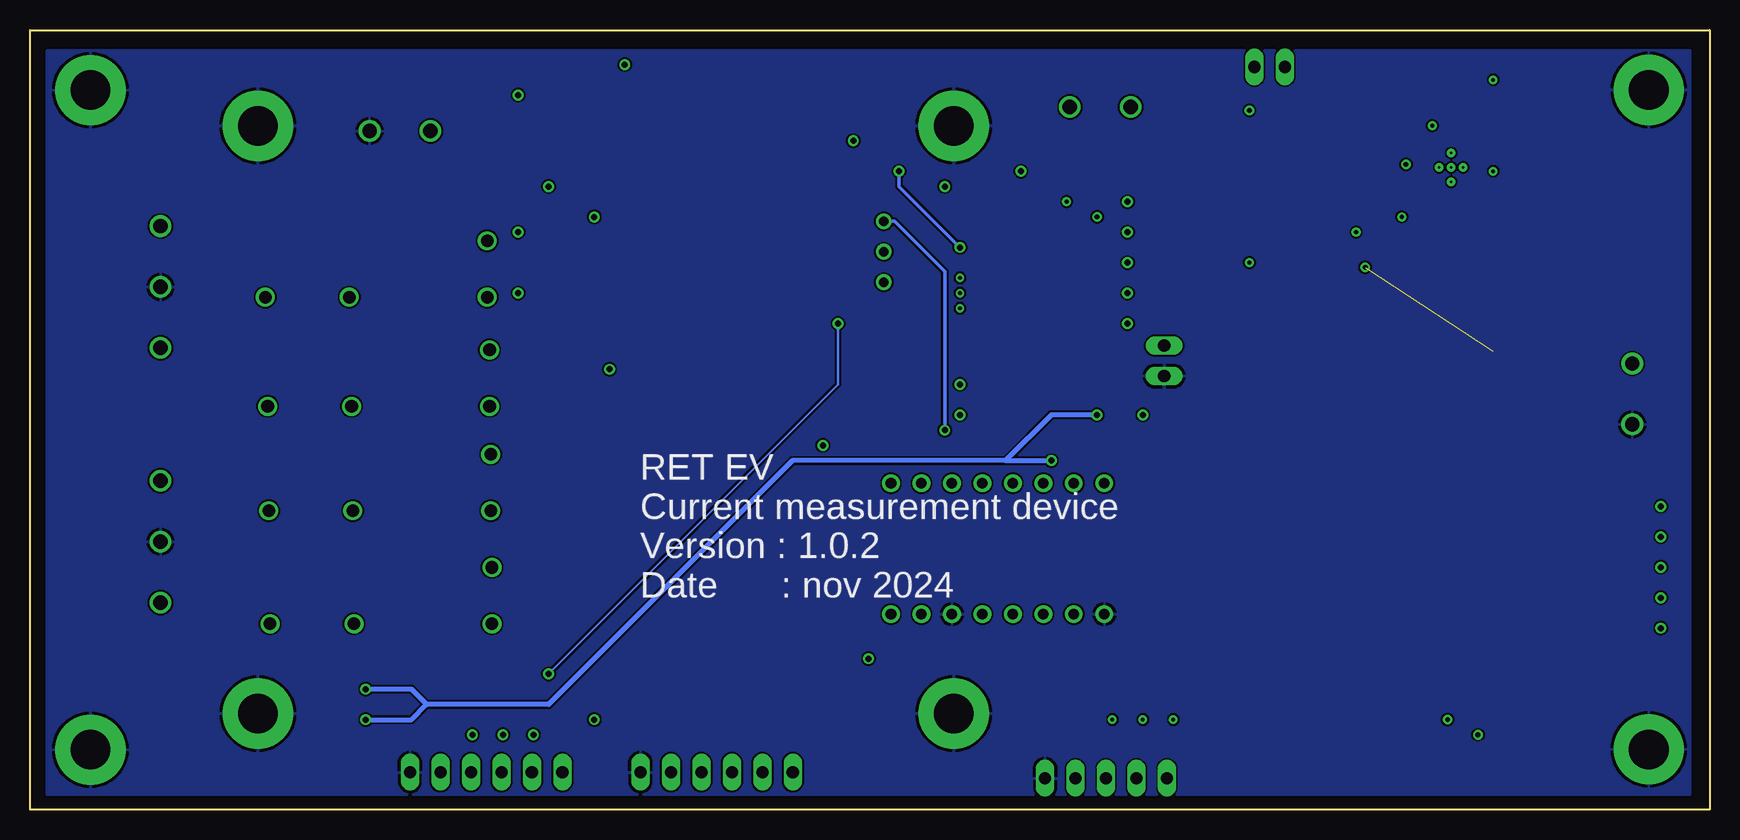
[diagram p6: board, bottom side, seen from below]

Size 140 x 65 mm. Coordinates in mm from the lower left corner, seen from the top.
Outline: 0,0 140,0 140,65 0,65 0,0
Copper layers (1+2*15+16): Top / Route2 / Route15 / Bottom
Stack-up 4 Layer Stack: Top SilkScreen Epoxy Ink / Top SolderMask SR:Green 0.0254mm Dk 4.3 / Top Surface Finish Lead-Free 0.02mm / Top CuFoil:007 0.035mm / Dielectric-1 Prepreg:001 0.064mm / Dielectric-2 Prepreg:001 0.064mm / Route2 CuFoil:007 0.035mm / Dielectric-3 Core:066 0.711mm / Route15 CuFoil:007 0.035mm / Dielectric-4 Prepreg:001 0.064mm / Dielectric-5 Prepreg:001 0.064mm / Bottom CuFoil:007 0.035mm / Bottom Surface Finish Lead-Free 0.02mm / Bottom SolderMask SR:Green 0.0254mm Dk 4.3 / Bottom SilkScreen Epoxy Ink
Design rules: minimum copper width 6mil, minimum drill size 0.35mm, copper clearance wire_polygon to wire_polygon 6mil, copper clearance wire_polygon to pad_smd 6mil, copper clearance wire_polygon to via 6mil, copper clearance pad_smd to pad_smd 6mil, copper clearance pad_smd to via 6mil, copper clearance via to via 6mil, copper clearance smd to pad (same net) 6mil, copper clearance smd to via (same net) 6mil, copper clearance smd to smd (same net) 6mil, dimension clearance 40mil, via restrict clearance 0mil, restrict clearance 0mil, drill distance 6mil, keepout clearance 0mil

### Footprints (pad centres in the part's own frame; a part is rotated, then mirrored left to right if it is on the bottom)
CAPC3216X135 = smd 1.165 x 1.815: 1 -1.475,0; 2 1.475,0
EEE1AA220WR = smd 2.5 x 1.6: 1 -1.75,0; 2 1.75,0
CAPC1608X90N = smd 0.81 x 0.94: 1 -0.67,0; 2 0.67,0
CAPC3216X180N = smd 0.62 x 1.82: 1 -1.6,0; 2 1.6,0
CAPC1608X90N' = smd 0.54 x 0.94: 1 -0.8,0; 2 0.8,0
CAPC3225X270N = smd 1.53 x 2.72: 1 -1.341,0; 2 1.341,0
CAPC2012X75N = smd 0.62 x 1.47: 1 -1,0; 2 1,0
SOD-323 = smd 1.14 x 0.52: A 1.04,0; C -1.04,0
LEDC3216X75N_FLAT-R = smd 0.962 x 1.712: A 1.525,0; C -1.525,0
T1210T8G = smd 3.7 x 1.3: 1 13.3,-2.54; 3 13.3,2.54 | smd 8.9 x 10.3: 2 2.7,0
DIOM5226X230N = smd 2.35 x 1.55: 1 -2.15,0; 2 2.15,0
3,3-PAD = drill 3.3 pad 5.842: B3,3 0,0
DIP1092W56P254L1905H432Q16B = drill 0.877 pad 1.477: 1 -5.46,8.89; 2 -5.46,6.35; 3 -5.46,3.81; 4 -5.46,1.27; 5 -5.46,-1.27; 6 -5.46,-3.81; 7 -5.46,-6.35; 8 -5.46,-8.89; 9 5.46,-8.89; 10 5.46,-6.35; 11 5.46,-3.81; 12 5.46,-1.27; 13 5.46,1.27; 14 5.46,3.81; 15 5.46,6.35; 16 5.46,8.89
SOP65P490X110-8N = smd 1.4 x 0.45: 1 -2.2,0.975; 2 -2.2,0.325; 3 -2.2,-0.325; 4 -2.2,-0.975; 5 2.2,-0.975; 6 2.2,-0.325; 7 2.2,0.325; 8 2.2,0.975
QFN50P300X300X80-17N = smd 0.8 x 0.3: 1 -1.5,0.75; 2 -1.5,0.25; 3 -1.5,-0.25; 4 -1.5,-0.75; 9 1.5,-0.75; 10 1.5,-0.25; 11 1.5,0.25; 12 1.5,0.75 | smd 0.3 x 0.8: 5 -0.75,-1.5; 6 -0.25,-1.5; 7 0.25,-1.5; 8 0.75,-1.5; 13 0.75,1.5; 14 0.25,1.5; 15 -0.25,1.5; 16 -0.75,1.5 | smd 1.76 x 1.76: 17 0,0
1X02 = drill 1.016 long: 1 -1.27,0; 2 1.27,0
1X05 = drill 1.016 long: 1 -5.08,0; 2 -2.54,0; 3 0,0; 4 2.54,0; 5 5.08,0
1X06 = drill 1.016 long: 1 -6.35,0; 2 -3.81,0; 3 -1.27,0; 4 1.27,0; 5 3.81,0; 6 6.35,0
XAL6060-103MEB = smd 1.43 x 5.5: 1 -2.02,0; 2 2.02,0
SDR1307270ML = smd 14 x 4.75: 1 0,-4.625; 2 0,4.625
RESC3216X70 = smd 1.165 x 1.815: 1 -1.475,0; 2 1.475,0
ZETTLER_5V_RELAY = drill 1.05: COIL+ 0,-4.7; COIL- 0,0; IN 11.5,-4.7; OUT 18.5,-4.7
TO-92-3_ONS = drill 0.813 pad 1.321: 1 0,0; 2 2.54,0; 3 5.08,0
SOT23_NXP-L = smd 0.508 x 1.016: 1 -0.953,-0.894; 2 0.953,-0.894; 3 0,0.796
DPR0010A = smd 0.6 x 0.3: 1 -1.9,1.6; 2 -1.9,0.8; 3 -1.9,0; 4 -1.9,-0.8; 5 -1.9,-1.6; 6 1.9,-1.6; 7 1.9,-0.8; 8 1.9,0; 9 1.9,0.8; 10 1.9,1.6 | smd 2.6 x 3: 11 0,0 | drill 0.203 pad 0.5: V -1,0; V_1 0,-1.2; V_2 0,0; V_3 0,1.2; V_4 1,0
TERMBLK_508-2N = drill 1.2: 1 0,0; 2 5.08,0
TERMBLK_508-3N = drill 1.2: 1 0,0; 2 5.08,0; 3 10.16,0

### Placement (x,y rotation side)
C1  67.16,32.68 0 top
C2  74.29,16.26 0 top
C3  57.87,49.14 0 top
C4  9.36,17.79 270 top
C5  16.18,3.53 180 top
C6  16.28,10.15 0 top
C7  28.38,4.01 0 top
C8  30.88,9.07 0 top
C9  17.15,13.67 180 top
C10  43.86,29.55 270 top
C11  CGA3E2X7R1H104K080AA  [CAPC1608X90N']  47.83,29.11 270 top
C17  13.85,52.89 270 top
C18  14.03,60.71 180 top
C19  43.05,46.56 270 top
C20  29.68,50.11 0 top
C21  21.64,60.19 180 top
C22  20.12,47.65 180 top
D1  89.96,56.48 270 top
D2  93.77,53.94 90 top
D3  88.69,43.78 270 top
D4  93.77,41.24 90 top
D5  88.69,31.08 270 top
D6  93.77,28.54 90 top
D7  88.69,19.65 270 top
D8  93.77,17.11 90 top
D9  15.33,38.17 0 top
D10  38.8,24.82 180 top
H1  134.96,59.99 0 top
H2  134.96,4.99 0 top
H3  5.06,5.01 0 top
H4  5.06,60 0 top
H5  63,8 0 top
H6  121,8 0 top
H7  63,57 0 top
H8  121,57 0 top
IC1  59.34,21.75 270 top
IC2  58.03,42.82 0 top
IC3  58.09,33.78 0 top
IC4  23.73,10.14 0 top
JP1  45.46,37.41 270 top
JP3  36.67,61.92 0 top
JP4  50.31,2.62 0 top
JP5  82.76,3.12 0 top
JP6  101.97,3.12 0 top
L1  29.11,57.49 0 top
L2  24.63,22.99 270 top
R1  51.43,45.38 270 top
R2  67.07,38.95 180 top
R3  34.18,3.79 180 top
R4  75.99,56.48 0 top
R5  75.99,43.78 0 top
R6  77.26,31.08 0 top
R7  77.46,23.85 0 top
R8  93.77,59.02 90 top
R9  93.77,46.32 90 top
R10  93.77,33.62 90 top
R11  93.77,22.19 90 top
R12  16.28,6.85 0 top
R13  15.28,45.81 0 top
R14  24.18,47.31 0 top
R15  37.46,41.21 90 top
R16  35.77,51.71 90 top
R17  35.73,47.11 90 top
R18  36.93,17.93 90 top
R19  36.93,12.61 90 top
R20  37.49,36.43 90 top
RELAY1  101.89,47.42 0 top
RELAY2  101.69,38.32 0 top
RELAY3  101.59,29.62 0 top
RELAY4  101.49,20.19 0 top
U1  68.83,49.05 270 top
U2  82.8,44.33 270 top
U3  82.8,22.74 270 top
U4  84.07,31.63 270 top
U5  82.8,55.76 270 top
U7  21.53,53.54 0 top
U$1  6.44,32.11 90 top
U$2  129.12,38.49 90 top
U$3  129.12,17.25 90 top
U$3_SENSOR  48.24,58.57 0 top
U$4  106.61,56.58 0 top

### Tracks (layer width: path | path; a pad name or v marks a point on that pad's centre or on a via)
!SYNC  (via drill 0.3)
  Top 0.2: v44.7,7.5 45.23,6.97 JP4.1 | v62.48,41.79 60.29,41.79 IC2.5
  Route15 0.2: v62.48,41.79 61.21,41.79 53.03,33.61 53.03,32.06 44.7,23.74 v44.7,7.5
+3V3  (via drill 0.5)
  Top 0.2: JP6.1 92.96,5.78 v92.96,7.5 | v70.1,12.58 69.4,12.58 IC1.15
  Route15 0.2: v70.1,12.58 87.88,12.58 v92.96,7.5
+5V  (via drill 0.35, 0.5)
  Top 0.2: v53.59,50.68 54.85,50.68 C3.1 56.39,44.36 IC2.1 IC2.2 | D1.C 92.94,60.5 R8.2 | v90.42,62.11 92.16,62.11 R8.2 | D3.C 91.67,47.8 R9.2 | R8.2 98.39,60.5 v99.31,59.57 | v99.31,43.06 101.55,43.06 RELAY1.COIL+ | v92.96,49.41 93.77,48.6 R9.2 | R9.2 94.12,48.14 | v91.69,36.71 93.31,35.09 R10.2 | R10.2 90.8,32.12 D5.C | 94.12,35.44 R10.2 | D7.C 91.67,23.67 R11.2 94.7,22.74 101.85,22.74 104.39,20.2 104.39,18.39 RELAY4.COIL+ | R10.2 97.23,31.63 104.39,31.63 105.66,30.36 105.66,26.55 104.03,24.92 RELAY3.COIL+ | R9.2 98.04,43.53 98.04,41.79 99.31,40.52 104.39,40.52 105.66,39.25 105.66,35.44 103.84,33.62 RELAY2.COIL+
  Top 0.254: C2.1 68.26,16.26 IC1.16
  Top 0.305: L1.2 32.86,55.76 | 34.54,55.76 35.77,54.53 R16.2 | 48.44,48.21 v48.51,48.14 | IC4.6 23.48,6.6 23.11,6.23 21.67,6.23 18.02,9.89 IC4.3
  Top 0.406: 32.86,55.76 34.54,55.76 | R16.2 40.74,48.21 C19.1 44.7,48.21 | 44.7,48.21 45.97,48.21 | 45.97,48.21 46.04,48.21 v48.51,50.68 | v48.51,48.14 46.04,48.14 45.97,48.21 | v48.51,45.6 45.97,45.6 | 45.97,45.6 44.7,46.87 44.7,48.21 | v48.51,43.06 45.97,45.6 | v48.51,40.52 45.97,43.06 45.97,45.6 | v4.06,25.28 7.87,25.28 9.36,23.79 9.36,21.47 | 9.36,21.47 C4.1 | v4.06,22.74 8.09,22.74 9.36,21.47 | v4.06,20.2 8.7,20.2 C4.1 | v4.06,17.66 7.48,17.66 | 7.48,17.66 C4.1 | v4.06,15.12 6.6,15.12 7.48,16 7.48,17.66 | C4.1 16.55,19.54 L2.1 | C4.1 9.36,18.59 10.52,17.44 10.52,16.28 14.22,12.58 16.76,12.58 17.76,11.58 C6.2 18.02,9.89
  Route15 0.2: v99.31,59.57 100.58,58.3 100.58,44.33 v99.31,43.06
  pour Route2: 1.52,63.38 1.52,1.15 138.68,1.15 138.68,63.38
+24V  (via drill 0.5)
  Top 0.305: C11.1 48.39,30.47 48.51,30.59 48.51,31.63 v47.24,32.9 | v57.4,53.22 53.32,53.22 U$3_SENSOR.2 | v63.75,51.95 63.75,50.81 65.02,49.54 | 65.02,49.54 65.51,49.05 U1.1 70.46,50.68 104.52,50.68 106.61,52.77 U$4.1 | IC3.7 60.41,34.22 61.12,34.22 61.29,34.4 61.29,35.11 60.29,36.11 60.29,37.63 58.67,39.25 58.67,45.6 59.94,46.87 v62.48,46.87 | v67.56,53.22 65.02,50.68 65.02,49.54 | IC3.4 58.34,30.36 62.48,30.36 v63.75,31.63
  Top 0.406: R18.2 40.95,23.42 D10.1 40.95,28.24 C10.1 46.59,31.15 C11.1 | v54.86,29.09 52.32,29.09 | 52.32,29.09 49.78,29.09 48.39,30.47 | v51.05,32.9 51.05,30.36 52.32,29.09 | v112.01,10.04 113.28,11.31 | 113.28,11.31 113.28,15.2 RELAY4.IN 112.99,24.82 RELAY3.IN 113.09,33.52 RELAY2.IN 113.39,33.82 RELAY1.IN | v112.01,7.5 113.28,8.77 113.28,11.31
  Route15 0.305: v57.4,53.22 57.4,43.06 | 57.4,43.06 v47.24,32.9 | 57.4,43.06 62.48,48.14 62.48,50.68 v63.75,51.95
  Bottom 0.305: v62.48,46.87 67.56,51.95 v67.56,53.22 | v63.75,31.63 63.75,44.87 67.93,49.05 U1.1
  Bottom 0.406: 58.67,29.09 76.45,29.09 96.77,8.77 106.93,8.77 | 58.67,29.09 v54.86,29.09 | 106.93,8.77 108.2,10.04 v112.01,10.04 | v112.01,7.5 108.2,7.5 106.93,8.77 | v51.05,32.9 54.86,32.9 58.67,29.09
BMS_OUT1
  Top 0.406: RELAY1.OUT 124.62,38.49 U$2.1
BMS_OUT2
  Top 0.406: RELAY2.OUT 129.24,33.62 132.33,36.71 132.33,45.44 U$2.3
DAC_OUT
  Top 0.2: JP3.1 35.4,57.44 40.89,51.95 49.78,51.95 53.59,48.14 53.59,43.06 54.16,42.5 | 54.16,42.5 IC2.3 | IC2.4 54.8,41.84 54.16,42.5
DIN  (via drill 0.3)
  Top 0.2: v49.78,7.5 50.31,6.97 JP4.3 | IC2.7 60.4,43.32 61.04,43.32 62.05,44.33 v62.48,44.33
  Route15 0.2: v49.78,7.5 57.62,15.34 58.46,15.34 59.01,15.9 59.01,16.73 64.75,22.47 64.75,27.6 65.02,27.88 65.02,43.06 63.75,44.33 v62.48,44.33
GND
  Top 0.2: IC4.7 23.98,9.89 IC4.17 24.57,10.14 24.73,10.29 25.13,10.29 IC4.11
  pour Top: 1.52,63.38 1.52,1.15 138.68,1.15 138.68,63.38
  pour Bottom: 1.52,63.38 1.52,1.15 138.68,1.15 138.68,63.38
IN1  (via drill 0.5)
  Top 0.2: v98.04,6.23 98.16,6.11 JP6.2 | v71.37,55.76 72.09,56.48 R4.1
  Route15 0.2: v98.04,6.23 90.42,13.85 76.45,13.85 71.37,18.93 71.37,43.95 70.46,44.86 70.46,50.69 71.37,51.61 v71.37,55.76
IN2  (via drill 0.5, 0.5 layers 15-16)
  Top 0.2: v72.64,40.52 72.64,41.91 R5.1 | JP6.3 100.7,6.11 v100.58,6.23
  Route15 0.2: v100.58,6.23 96.77,10.04 v96.77,11.31
  Bottom 0.2: v96.77,11.31 72.64,35.44 v72.64,40.52
IN3  (via drill 0.5)
  Top 0.2: R6.1 75.07,30.36 v73.91,30.36 | v103.12,6.23 103.24,6.11 JP6.4
  Route15 0.2: v103.12,6.23 82.8,26.55 76.45,26.55 73.91,29.09 v73.91,30.36
IN4
  Top 0.2: R7.1 91.07,8.77 101.85,8.77 105.78,4.84 JP6.5
N$1  (via drill 0.5)
  Top 0.305: v62.48,35.44 62.48,34.94 61,33.45 IC3.6
  Route2 0.305: v62.48,35.44 71.37,44.33 71.37,45.6 70.46,46.51 U1.2
N$2  (via drill 0.4)
  Top 0.2: JP3.2 37.94,58.71 v38.35,58.3 | v51.05,49.41 51.05,47.23 R1.1
  Route15 0.2: v38.35,58.3 43.43,53.22 48.51,53.22 51.05,50.68 v51.05,49.41
N$3  (via drill 0.5)
  Top 0.305: IC3.5 60.38,32.9 v62.48,32.9
  Route2 0.305: v62.48,32.9 61.21,34.17 61.21,37.98 67.2,43.97 U1.3
N$4
  Top 0.2: R1.2 53.59,41.75 53.59,35.44 54.92,34.11 IC3.2
N$5
  Top 0.2: R5.2 80.4,43.78 U2.1
N$6
  Top 0.305: IC1.1 68.23,30.14 C1.1 65.59,32.77 R2.2 64.05,38.95 63.75,39.25 63.75,48.14 59.94,51.95 53.94,51.95 52.86,53.03 52.86,53.95 U$3_SENSOR.1
N$7
  Top 0.2: JP5.4 84.03,13.89 76.45,21.47 58.17,21.47 IC1.10
N$8
  Top 0.2: JP5.3 81.49,15.16 76.45,20.2 59.44,20.2 IC1.11
N$9
  Top 0.2: JP5.2 78.95,16.43 76.45,18.93 60.71,18.93 IC1.12
N$10
  Top 0.2: JP5.1 66.95,12.58 64.32,12.58 IC1.13
N$11
  Top 0.2: RELAY2.COIL- 95.17,38.32 D4.C 91.72,39.72 D3.A 85.75,42.74 84.16,44.33 U2.3
N$12
  Top 0.2: R9.1 D4.A
N$13
  Top 0.2: R6.2 80.24,32.58 U4.1
N$14
  Top 0.2: R4.2 81.67,56.48 U5.1
N$15
  Top 0.2: R8.1 D2.A
N$16  (via drill 0.5)
  Top 0.2: v99.31,48.14 101.17,48.14 RELAY1.COIL- | v96.77,51.95 94.23,51.95 D2.C 92.98,52.42 D1.A 85.75,55.44 85.43,55.76 U5.3
  Route15 0.2: v96.77,51.95 99.31,49.41 v99.31,48.14
N$17
  Top 0.2: RELAY3.COIL- 98.98,27.02 D6.C 91.72,27.02 D5.A 87.02,30.04 85.43,31.63 U4.3
N$18
  Top 0.2: R10.1 D6.A
N$19
  Top 0.2: RELAY4.COIL- 98.38,20.19 D8.C 91.72,15.58 D7.A 86.93,18.61 86.61,18.93 86.61,20.88 84.75,22.74 U3.3
N$20
  Top 0.2: R11.1 D8.A
N$21
  Top 0.2: U3.1 79.09,23.69 R7.2
N$22
  Top 0.305: 9.29,54.64 C17.1 19.33,54.64 U7.2
  Top 0.406: U$1.2 7.87,38.62 7.87,53.22 9.29,54.64
N$23
  Top 0.2: R13.2 18.03,47.08 18.03,50.34 U7.5
N$24  (via drill 0.3)
  Top 0.2: U7.4 19.15,53.22 v18.03,53.22 | v18.03,60.84 15.63,60.84 C18.1
  Route15 0.2: v18.03,60.84 v18.03,53.22
N$25
  Top 0.2: C22.1 21.46,47.31 R14.1
N$26
  Top 0.2: U7.7 25.58,52.74 C20.1 28.2,49.86 R14.2
N$27
  Top 0.305: 19.92,60.19 C21.2
  Top 0.406: U7.1 18.03,56.74 18.03,58.3 19.92,60.19
N$28  (via drill 0.4)  (1 unrouted)
  Top 0.305: U7.9 23.94,54.34 | 28.63,45.13 v28.7,45.2
  Top 0.406: 25.81,57.49 24.69,58.61 | 24.69,58.61 C21.1 | L1.1 25.81,57.49 | 24.69,58.61 24.69,55.76 24.69,55.54 24.69,55.09 23.94,54.34 | v25.3,53.8 25.81,54.31 25.81,57.49
  Route15 0.305: v28.7,45.2 28.59,45.2 24.38,49.41 24.38,52.88 v25.3,53.8
N$29  (via drill 0.35)
  Top 0.2: U7.10 23.11,55.46 v23.11,57.03 | v38.35,45.6 38.35,43.58 R15.2
  Route15 0.2: v38.35,45.6 26.92,57.03 v23.11,57.03
N$30  (via drill 0.35)
  Top 0.2: R16.1 33.67,48.14 v29.46,48.14 | U7.6 25.65,49.72 v25.65,49.41
  Top 0.305: R16.1 35.77,48.62 R17.2
  Route15 0.2: v25.65,49.41 26.92,48.14 v29.46,48.14
N$31
  Top 0.254: IC4.2 21.1,10.39 C9.1
N$32
  Top 0.2: IC4.8 24.48,6.44 24.53,6.38 | 24.53,6.38 C7.1 | C5.1 17.81,3.69 23.11,3.69 24.53,5.11 24.53,6.38
N$33
  Top 0.2: C7.2 30.07,3.79 R3.2
N$34
  Top 0.2: IC4.10 28.59,9.89 C8.1
N$35  (via drill 0.4)
  Top 0.2: R12.2 18.38,6.23 v19.3,6.23 | v21.84,7.5 IC4.5
  Route15 0.2: v19.3,6.23 20.57,7.5 v21.84,7.5
N$36
  Top 0.305: IC4.13 IC4.14
  Top 0.406: IC4.12 29.25,14.91 29.25,16.39 | 29.25,16.39 L2.2 34.82,22.99 D10.2 | IC4.13 29.23,16.39 29.25,16.39
N$37
  Top 0.2: IC4.9 28.39,6.23 33.27,6.23 34.54,7.5 34.54,15.12 35.88,16.45 R18.1 R19.2
N$38
  Top 0.2: R15.1 40.41,39.73 41.46,38.68 | 41.46,38.68 JP1.1 | R20.2 40.68,37.91 41.46,38.68
SCADA_OUT1
  Top 0.406: RELAY3.OUT 127.76,17.25 U$3.1
SCADA_OUT2
  Top 0.406: RELAY4.OUT 121.63,13.85 131.06,13.85 132.33,15.12 132.33,25.28 130.2,27.41 U$3.3
SCLK  (via drill 0.3)
  Top 0.2: v47.24,7.5 47.77,6.97 JP4.2 | IC2.6 60.4,42.67 61.04,42.67 61.43,43.06 v62.48,43.06
  Route15 0.2: JP4.2 47.77,19.46 54.59,26.28 54.59,27.6 55.14,28.16 56.46,28.16 63.75,35.44 63.75,41.79 v62.48,43.06

### Text on the board
SilkscreenTop: + - | - | + | 4-20mA | BMS | DAC OUT | 4-20mA IN | Vin: / 24-48V | 3.3V signal | 1 GND 2 | GND | + | - | 1 GND 2 | SCADA | CLK ADC | 3.3V | !SNYC | 5V | SLCK | Din | +5V | GND | DOUT ADC | DIN ADC | SHDN/!CS | GND | IN1 | IN2 | IN3 | IN4 | GND
SilkscreenBottom: RET EV / Current measurement device / Version : 1.0.2 / Date : nov 2024